# Altium schematic sheet main_processor.SchDoc
size A4
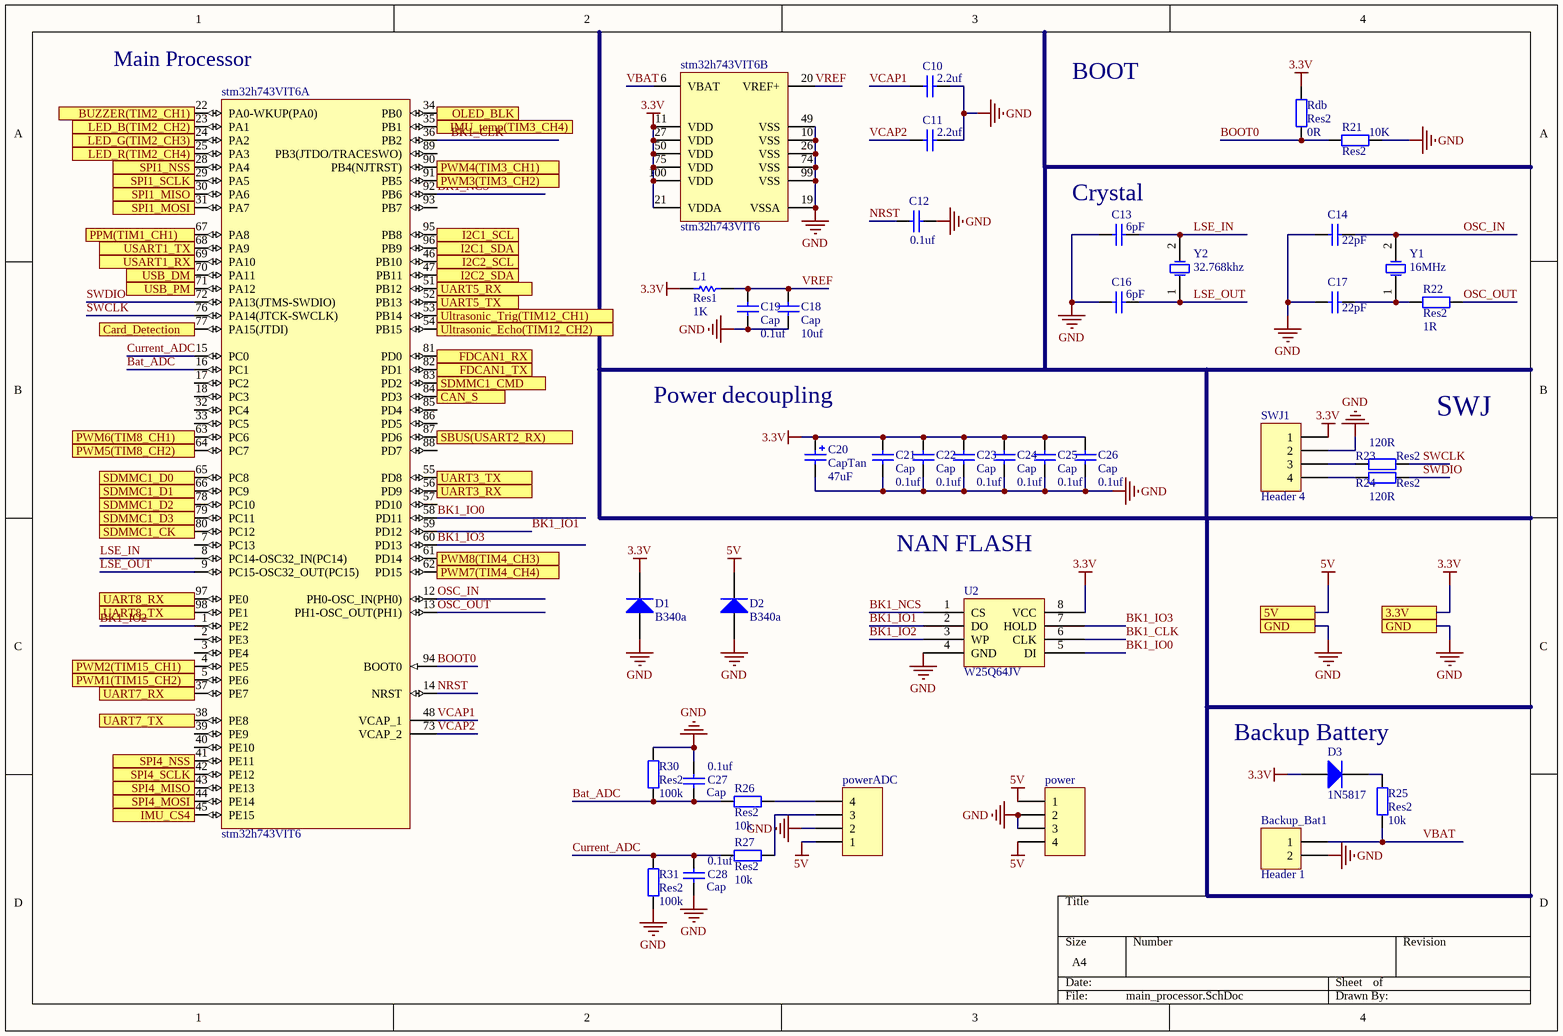
[diagram p0: main_processor.SchDoc]

## Parts
Backup_Bat1  Header 1  [Battery-MS621]
C10  value 2.2uf  [0603]  (hidden comment: Cap)
C11  value 2.2uf  [0603]  (hidden comment: Cap)
C12  value 0.1uf  [0603]  (hidden comment: Cap)
C13  value 6pF  [0603]  (hidden comment: Cap)
C14  value 22pF  [0603]  (hidden comment: Cap)
C16  value 6pF  [0603]  (hidden comment: Cap)
C17  value 22pF  [0603]  (hidden comment: Cap)
C18  Cap  value 10uf  [0603]
C19  Cap  value 0.1uf  [0603]
C20  CapTan  value 47uF  [1206_P]
C21  Cap  value 0.1uf  [0603]
C22  Cap  value 0.1uf  [0603]
C23  Cap  value 0.1uf  [0603]
C24  Cap  value 0.1uf  [0603]
C25  Cap  value 0.1uf  [0603]
C26  Cap  value 0.1uf  [0603]
C27  Cap  value 0.1uf  [0603]
C28  Cap  value 0.1uf  [0603]
D1  B340a  [DO_214_AC]
D2  B340a  [DO_214_AC]
D3  1N5817  [SOD323]
L1  Res1  value 1K  [AXIAL-0.3]
power  Header 2  [SH_1.25mm_LT_4P]  (value not drawn)
powerADC  Header 2  [SH_1.25mm_LT_4P]  (value not drawn)
R21  Res2  value 10K  [0603]
R22  Res2  value 1R  [0603]
R23  Res2  value 120R  [0603]
R24  Res2  value 120R  [0603]
R25  Res2  value 10k  [0603]
R26  Res2  value 10k  [0603]
R27  Res2  value 10k  [0603]
R30  Res2  value 100k  [0603]
R31  Res2  value 100k  [0603]
Rdb  Res2  value 0R  [0603]
stm32h743VIT6  stm32h743VIT6  [LQFP100-14x14mm]  (parts A,B of 2)
SWJ1  Header 4  [SH_1.25mm_LT_4P]
U2  W25Q64JV  [W25Q SOP8]
Y1  16MHz  [Crystal_SMD_3225]
Y2  32.768khz  [FC135]

## Ports
3.3V, 5V, BUZZER(TIM2_CH1), CAN_S, Card_Detection, FDCAN1_RX, FDCAN1_TX, GND, I2C1_SCL, I2C1_SDA, I2C2_SCL, I2C2_SDA, IMU_CS4, IMU_temp(TIM3_CH4), LED_B(TIM2_CH2), LED_G(TIM2_CH3), LED_R(TIM2_CH4), OLED_BLK, PPM(TIM1_CH1), PWM1(TIM15_CH2), PWM2(TIM15_CH1), PWM3(TIM3_CH2), PWM4(TIM3_CH1), PWM5(TIM8_CH2), PWM6(TIM8_CH1), PWM7(TIM4_CH4), PWM8(TIM4_CH3), SBUS(USART2_RX), SDMMC1_CK, SDMMC1_CMD, SDMMC1_D0, SDMMC1_D1, SDMMC1_D2, SDMMC1_D3, SPI1_MISO, SPI1_MOSI, SPI1_NSS, SPI1_SCLK, SPI4_MISO, SPI4_MOSI, SPI4_NSS, SPI4_SCLK, UART3_RX, UART3_TX, UART5_RX, UART5_TX, UART7_RX, UART7_TX, UART8_RX, UART8_TX, Ultrasonic_Echo(TIM12_CH2), Ultrasonic_Trig(TIM12_CH1), USART1_RX, USART1_TX, USB_DM, USB_PM

## Nets
3.3V: C20.1 C21.2 C22.2 C23.2 C24.2 C25.2 C26.2 D1.2(K) D3.1(A) L1.1 Rdb.2 stm32h743VIT6.11(VDD) stm32h743VIT6.21(VDDA) stm32h743VIT6.27(VDD) stm32h743VIT6.50(VDD) stm32h743VIT6.75(VDD) stm32h743VIT6.100(VDD) SWJ1.1 U2.8(VCC) ; port 3.3V
5V: D2.2(K) power.1 power.4 powerADC.1 ; port 5V
GND: Backup_Bat1.2 C10.2 C11.2 C12.1 C13.1 C14.1 C16.1 C17.1 C18.1 C19.1 C20.2 C21.1 C22.1 C23.1 C24.1 C25.1 C26.1 C27.2 C28.1 D1.1(A) D2.1(A) power.2 power.3 powerADC.2 R21.2 R30.1 R31.2 stm32h743VIT6.10(VSS) stm32h743VIT6.19(VSSA) stm32h743VIT6.26(VSS) stm32h743VIT6.49(VSS) stm32h743VIT6.74(VSS) stm32h743VIT6.99(VSS) SWJ1.2 U2.4(GND) ; port GND
Bat_ADC: C27.1 R26.2 R30.2 stm32h743VIT6.16(PC1)
BK1_CLK: stm32h743VIT6.36(PB2) U2.6(CLK)
BK1_IO0: stm32h743VIT6.58(PD11) U2.5(DI)
BK1_IO1: stm32h743VIT6.59(PD12) U2.2(DO)
BK1_IO2: stm32h743VIT6.1(PE2) U2.3(WP)
BK1_IO3: stm32h743VIT6.60(PD13) U2.7(HOLD)
BK1_NCS: stm32h743VIT6.92(PB6) U2.1(CS)
BOOT0: R21.1 Rdb.1 stm32h743VIT6.94(BOOT0)
BUZZER(TIM2_CH1): stm32h743VIT6.22(PA0-WKUP(PA0)) ; port BUZZER(TIM2_CH1)
CAN_S: stm32h743VIT6.84(PD3) ; port CAN_S
Card_Detection: stm32h743VIT6.77(PA15(JTDI)) ; port Card_Detection
Current_ADC: C28.2 R27.2 R31.1 stm32h743VIT6.15(PC0)
FDCAN1_RX: stm32h743VIT6.81(PD0) ; port FDCAN1_RX
FDCAN1_TX: stm32h743VIT6.82(PD1) ; port FDCAN1_TX
I2C1_SCL: stm32h743VIT6.95(PB8) ; port I2C1_SCL
I2C1_SDA: stm32h743VIT6.96(PB9) ; port I2C1_SDA
I2C2_SCL: stm32h743VIT6.46(PB10) ; port I2C2_SCL
I2C2_SDA: stm32h743VIT6.47(PB11) ; port I2C2_SDA
IMU_CS4: stm32h743VIT6.45(PE15) ; port IMU_CS4
IMU_temp(TIM3_CH4): stm32h743VIT6.35(PB1) ; port IMU_temp(TIM3_CH4)
LED_B(TIM2_CH2): stm32h743VIT6.23(PA1) ; port LED_B(TIM2_CH2)
LED_G(TIM2_CH3): stm32h743VIT6.24(PA2) ; port LED_G(TIM2_CH3)
LED_R(TIM2_CH4): stm32h743VIT6.25(PA3) ; port LED_R(TIM2_CH4)
LSE_IN: C13.2 stm32h743VIT6.8(PC14-OSC32_IN(PC14)) Y2.2(OSC2)
LSE_OUT: C16.2 stm32h743VIT6.9(PC15-OSC32_OUT(PC15)) Y2.1(OSC1)
NRST: C12.2 stm32h743VIT6.14(NRST)
OLED_BLK: stm32h743VIT6.34(PB0) ; port OLED_BLK
OSC_IN: C14.2 stm32h743VIT6.12(PH0-OSC_IN(PH0)) Y1.2(OSC2)
OSC_OUT: R22.1 stm32h743VIT6.13(PH1-OSC_OUT(PH1))
PPM(TIM1_CH1): stm32h743VIT6.67(PA8) ; port PPM(TIM1_CH1)
PWM1(TIM15_CH2): stm32h743VIT6.5(PE6) ; port PWM1(TIM15_CH2)
PWM2(TIM15_CH1): stm32h743VIT6.4(PE5) ; port PWM2(TIM15_CH1)
PWM3(TIM3_CH2): stm32h743VIT6.91(PB5) ; port PWM3(TIM3_CH2)
PWM4(TIM3_CH1): stm32h743VIT6.90(PB4(NJTRST)) ; port PWM4(TIM3_CH1)
PWM5(TIM8_CH2): stm32h743VIT6.64(PC7) ; port PWM5(TIM8_CH2)
PWM6(TIM8_CH1): stm32h743VIT6.63(PC6) ; port PWM6(TIM8_CH1)
PWM7(TIM4_CH4): stm32h743VIT6.62(PD15) ; port PWM7(TIM4_CH4)
PWM8(TIM4_CH3): stm32h743VIT6.61(PD14) ; port PWM8(TIM4_CH3)
SBUS(USART2_RX): stm32h743VIT6.87(PD6) ; port SBUS(USART2_RX)
SDMMC1_CK: stm32h743VIT6.80(PC12) ; port SDMMC1_CK
SDMMC1_CMD: stm32h743VIT6.83(PD2) ; port SDMMC1_CMD
SDMMC1_D0: stm32h743VIT6.65(PC8) ; port SDMMC1_D0
SDMMC1_D1: stm32h743VIT6.66(PC9) ; port SDMMC1_D1
SDMMC1_D2: stm32h743VIT6.78(PC10) ; port SDMMC1_D2
SDMMC1_D3: stm32h743VIT6.79(PC11) ; port SDMMC1_D3
SPI1_MISO: stm32h743VIT6.30(PA6) ; port SPI1_MISO
SPI1_MOSI: stm32h743VIT6.31(PA7) ; port SPI1_MOSI
SPI1_NSS: stm32h743VIT6.28(PA4) ; port SPI1_NSS
SPI1_SCLK: stm32h743VIT6.29(PA5) ; port SPI1_SCLK
SPI4_MISO: stm32h743VIT6.43(PE13) ; port SPI4_MISO
SPI4_MOSI: stm32h743VIT6.44(PE14) ; port SPI4_MOSI
SPI4_NSS: stm32h743VIT6.41(PE11) ; port SPI4_NSS
SPI4_SCLK: stm32h743VIT6.42(PE12) ; port SPI4_SCLK
SWCLK: R23.1 stm32h743VIT6.76(PA14(JTCK-SWCLK))
SWDIO: R24.1 stm32h743VIT6.72(PA13(JTMS-SWDIO))
UART3_RX: stm32h743VIT6.56(PD9) ; port UART3_RX
UART3_TX: stm32h743VIT6.55(PD8) ; port UART3_TX
UART5_RX: stm32h743VIT6.51(PB12) ; port UART5_RX
UART5_TX: stm32h743VIT6.52(PB13) ; port UART5_TX
UART7_RX: stm32h743VIT6.37(PE7) ; port UART7_RX
UART7_TX: stm32h743VIT6.38(PE8) ; port UART7_TX
UART8_RX: stm32h743VIT6.97(PE0) ; port UART8_RX
UART8_TX: stm32h743VIT6.98(PE1) ; port UART8_TX
Ultrasonic_Echo(TIM12_CH2): stm32h743VIT6.54(PB15) ; port Ultrasonic_Echo(TIM12_CH2)
Ultrasonic_Trig(TIM12_CH1): stm32h743VIT6.53(PB14) ; port Ultrasonic_Trig(TIM12_CH1)
USART1_RX: stm32h743VIT6.69(PA10) ; port USART1_RX
USART1_TX: stm32h743VIT6.68(PA9) ; port USART1_TX
USB_DM: stm32h743VIT6.70(PA11) ; port USB_DM
USB_PM: stm32h743VIT6.71(PA12) ; port USB_PM
VBAT: Backup_Bat1.1 R25.2 stm32h743VIT6.6(VBAT)
VCAP1: C10.1 stm32h743VIT6.48(VCAP_1)
VCAP2: C11.1 stm32h743VIT6.73(VCAP_2)
VREF: C18.2 C19.2 L1.2 stm32h743VIT6.20(VREF+)
NetC17_2: C17.2 R22.2 Y1.1(OSC1)
NetD3_2: D3.2(K) R25.1
NetpowerADC_3: powerADC.3 R27.1
NetpowerADC_4: powerADC.4 R26.1
NetR23_2: R23.2 SWJ1.3
NetR24_2: R24.2 SWJ1.4

Not connected (* = marked no-connect by the designer): stm32h743VIT6 2(PE3) 3(PE4) 7(PC13) 17(PC2) 18(PC3) 32(PC4) 33(PC5) 39(PE9) 40(PE10) 57(PD10) 85(PD4) 86(PD5) 88(PD7) 89(PB3(JTDO/TRACESWO)) 93(PB7)

## Notes on the sheet
- (near stm32h743VIT6) Main Processor
- BOOT
- (near C13) Crystal
- Power decoupling
- SWJ
- NAN FLASH
- Backup Battery

## Library data of the parts
Backup_Bat1 = Header 2: Header, 2-Pin; LatestRevisionDate: 17-Jul-2002; LatestRevisionNote: Re-released for DXP Platform.; Publisher: Altium Limited
C10-C14 C16-C19 C21-C28 = Cap: Capacitor; Published: 8-Jun-2000; LatestRevisionDate: 17-Jul-2002; LatestRevisionNote: Re-released for DXP Platform.; PackageReference: RAD-0.3; Publisher: Altium Limited; PackageDescription: Radial Cap, Thru-Hole; 2 Leads; 0.3 in Pin Spacing
C20 = Cap Pol2: Polarized Capacitor (Axial); Published: 8-Jun-2000; LatestRevisionDate: 17-Jul-2002; LatestRevisionNote: Re-released for DXP Platform.; PackageReference: POLAR0.8; Publisher: Altium Limited; PackageDescription: Polarized Capacitor; 2 Leads
D1-D3 = Diode: Default Diode; Published: 8-Jun-2000; LatestRevisionDate: 17-Jul-2002; LatestRevisionNote: Re-released for DXP Platform.; PackageVersion: Sep-1996; PackageReference: SMC; Publisher: Altium Limited; PackageDescription: DO-214-AB/SMC; 2 C-Bend Leads; Body 7.9 x 5.9 mm, inc. leads (LxW); Code_JEDEC: DO-214-AB
L1 = Res1: Resistor; Published: 8-Jun-2000; LatestRevisionDate: 17-Jul-2002; LatestRevisionNote: Re-released for DXP Platform.; PackageReference: AXIAL-0.3; Publisher: Altium Limited; PackageDescription: Axial Device, Thru-Hole; 2 Leads; 0.3 in Pin Spacing
power powerADC SWJ1 = Header 4: Header, 4-Pin; LatestRevisionDate: 17-Jul-2002; LatestRevisionNote: Re-released for DXP Platform.; Publisher: Altium Limited
R21-R27 R30 R31 Rdb = Res2: Resistor; Published: 8-Jun-2000; LatestRevisionDate: 17-Jul-2002; LatestRevisionNote: Re-released for DXP Platform.; PackageReference: AXIAL-0.4; Publisher: Altium Limited; PackageDescription: Axial Device, Thru-Hole; 2 Leads; 0.4 in Pin Spacing
Y1 Y2 = XTAL: Crystal Oscillator; Published: 8-Jun-2000; LatestRevisionDate: 17-Jul-2002; LatestRevisionNote: Re-released for DXP Platform.; Publisher: Altium Limited